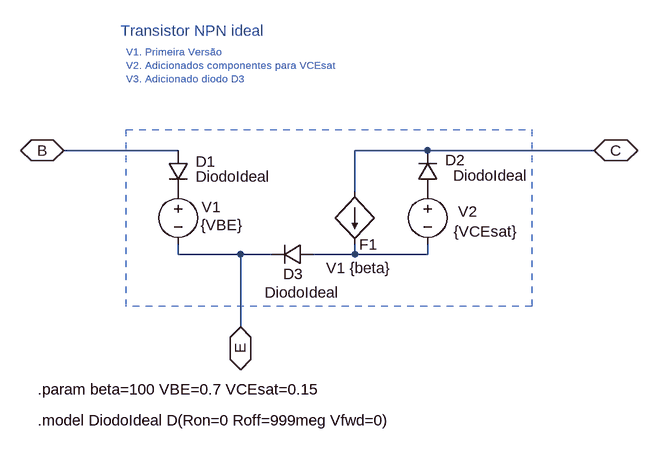
[diagram p0: schematic BJT_NPN_ideal.asc]
BJT_NPN_ideal.asc, the LTspice schematic file:
Version 4
SHEET 1 1136 728
WIRE 176 -448 0 -448
WIRE 560 -448 448 -448
WIRE 816 -448 560 -448
WIRE 448 -384 448 -448
WIRE 176 -288 176 -304
WIRE 272 -288 176 -288
WIRE 320 -288 272 -288
WIRE 448 -288 448 -304
WIRE 448 -288 384 -288
WIRE 560 -288 560 -304
WIRE 560 -288 448 -288
WIRE 272 -176 272 -288
FLAG 0 -448 B
IOPIN 0 -448 BiDir
FLAG 272 -176 E
IOPIN 272 -176 BiDir
FLAG 816 -448 C
IOPIN 816 -448 BiDir
SYMBOL voltage 176 -400 R0
WINDOW 123 0 0 Left 0
WINDOW 39 0 0 Left 0
WINDOW 3 35 67 Left 2
WINDOW 0 36 39 Left 2
SYMATTR Value {VBE}
SYMATTR InstName V1
SYMBOL f 448 -384 R0
WINDOW 3 -44 117 Left 2
WINDOW 0 7 81 Left 2
SYMATTR Value V1 {beta}
SYMATTR InstName F1
SYMBOL diode 160 -448 R0
WINDOW 0 43 17 Left 2
WINDOW 3 43 40 Left 2
SYMATTR InstName D1
SYMATTR Value DiodoIdeal
SYMBOL voltage 560 -400 R0
WINDOW 123 0 0 Left 0
WINDOW 39 0 0 Left 0
WINDOW 3 40 77 Left 2
WINDOW 0 47 46 Left 2
SYMATTR Value {VCEsat}
SYMATTR InstName V2
SYMBOL diode 576 -384 R180
WINDOW 0 -42 49 Left 2
WINDOW 3 -139 25 Left 2
SYMATTR InstName D2
SYMATTR Value DiodoIdeal
SYMBOL diode 384 -304 R90
WINDOW 0 62 31 VBottom 2
WINDOW 3 59 17 VTop 2
SYMATTR InstName D3
SYMATTR Value DiodoIdeal
TEXT -40 -80 Left 2 !.param beta=100 VBE=0.7 VCEsat=0.15
TEXT -40 -32 Left 2 !.model DiodoIdeal D(Ron=0 Roff=999meg Vfwd=0)
TEXT 88 -632 Left 2 ;Transistor NPN ideal
TEXT 96 -600 Left 1 ;V1. Primeira Versão\nV2. Adicionados componentes para VCEsat\nV3. Adicionado diodo D3
RECTANGLE Normal 720 -208 96 -480 2

The netlist it stands for:
* BJT_NPN_ideal.asc
V1 P001 E {VBE}
F1 C N001 V1 {beta}
D1 B P001 DiodoIdeal
V2 P002 N001 {VCEsat}
D2 P002 C DiodoIdeal
D3 N001 E DiodoIdeal
.model D D
.lib standard.dio
.param beta=100 VBE=0.7 VCEsat=0.15
.model DiodoIdeal D(Ron=0 Roff=999meg Vfwd=0)
* Transistor NPN ideal
* V1. Primeira Versão
* V2. Adicionados componentes para VCEsat
* V3. Adicionado diodo D3
.backanno
.end